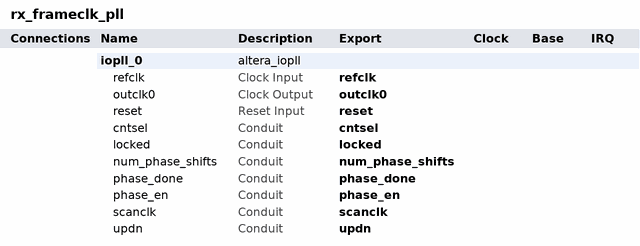
[diagram p0: system contents]
# Platform Designer (Qsys) system rx_frameclk_pll, Arria 10 10AX115S3F45E2SG
# Parameters at their usual value, and those the tool derives, are not listed.
package require -exact qsys 16.0
create_system rx_frameclk_pll
set_project_property DEVICE_FAMILY {Arria 10}
set_project_property DEVICE 10AX115S3F45E2SG

add_instance iopll_0 altera_iopll 16.0
set_instance_property iopll_0 AUTO_EXPORT true
set_instance_parameter_value iopll_0 gui_actual_duty_cycle0 50.0
set_instance_parameter_value iopll_0 gui_actual_output_clock_frequency0 100.0
set_instance_parameter_value iopll_0 gui_actual_phase_shift0 0.0
set_instance_parameter_value iopll_0 gui_actual_phase_shift_deg0 0.0
set_instance_parameter_value iopll_0 gui_clock_name_global false
set_instance_parameter_value iopll_0 gui_clock_to_compensate 0
set_instance_parameter_value iopll_0 gui_device_speed_grade 1
set_instance_parameter_value iopll_0 gui_en_dps_ports true
set_instance_parameter_value iopll_0 gui_en_lvds_ports Disabled
set_instance_parameter_value iopll_0 gui_existing_mif_file_path {~/pll.mif}
set_instance_parameter_value iopll_0 gui_lock_setting {Low Lock Time}
set_instance_parameter_value iopll_0 gui_mif_config_name unnamed
set_instance_parameter_value iopll_0 gui_mif_gen_options {Generate New MIF File}
set_instance_parameter_value iopll_0 gui_new_mif_file_path {~/pll.mif}
set_instance_parameter_value iopll_0 gui_number_of_clocks 1
set_instance_parameter_value iopll_0 gui_operation_mode normal
set_instance_parameter_value iopll_0 gui_output_clock_frequency0 40.0
set_instance_parameter_value iopll_0 gui_reference_clock_frequency 240.0
set_instance_parameter_value iopll_0 gui_use_NDFB_modes false
set_instance_parameter_value iopll_0 gui_use_locked true
set_instance_parameter_value iopll_0 gui_vco_frequency 600.0
set_instance_parameter_value iopll_0 system_info_device_component 10AX115S3F45E2SG
set_instance_parameter_value iopll_0 system_info_device_speed_grade 2
set_instance_parameter_value iopll_0 system_part_trait_speed_grade 3

# exported interfaces
add_interface cntsel conduit end
set_interface_property cntsel EXPORT_OF iopll_0.cntsel
add_interface locked conduit end
set_interface_property locked EXPORT_OF iopll_0.locked
add_interface num_phase_shifts conduit end
set_interface_property num_phase_shifts EXPORT_OF iopll_0.num_phase_shifts
add_interface outclk0 clock source
set_interface_property outclk0 EXPORT_OF iopll_0.outclk0
add_interface phase_done conduit end
set_interface_property phase_done EXPORT_OF iopll_0.phase_done
add_interface phase_en conduit end
set_interface_property phase_en EXPORT_OF iopll_0.phase_en
add_interface refclk clock sink
set_interface_property refclk EXPORT_OF iopll_0.refclk
add_interface reset reset sink
set_interface_property reset EXPORT_OF iopll_0.reset
add_interface scanclk conduit end
set_interface_property scanclk EXPORT_OF iopll_0.scanclk
add_interface updn conduit end
set_interface_property updn EXPORT_OF iopll_0.updn

set_interconnect_requirement {$system} qsys_mm.clockCrossingAdapter HANDSHAKE
set_interconnect_requirement {$system} qsys_mm.enableEccProtection FALSE
set_interconnect_requirement {$system} qsys_mm.insertDefaultSlave FALSE
set_interconnect_requirement {$system} qsys_mm.maxAdditionalLatency 1

save_system rx_frameclk_pll.qsys
